# EAGLE schematic power5V (EAGLE 9.6.2)
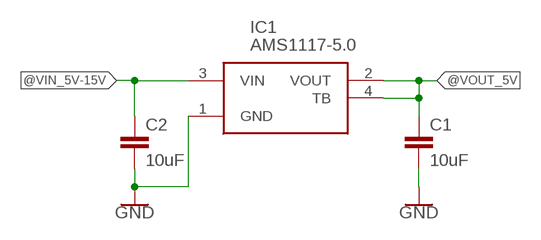
[diagram p0: schematic, sheet 1]

## Parts
C1  10uF  10UF-0603-6.3V-20%  [0603]
C2  10uF  10UF-0603-6.3V-20%  [0603]
IC1  AMS1117-5.0  [SOT290P700X180-4N]

## Nets
@VIN_5V-15V: C2.1 IC1.3(VIN)
@VOUT_5V: C1.1 IC1.2(VOUT) IC1.4(TB)
GND: C1.2 C2.2 IC1.1(GND)

## Library data of the parts
C1 C2 = SparkFun-Capacitors:10UF: 10.0µF ceramic capacitors A capacitor is a passive two-terminal electrical component used to store electrical energy temporarily in an electric field.; PROD_ID: CAP-11015
IC1 = AMS1117-5.0:AMS1117-5.0: Low Dropout Regulators(LDO) SOT-223 RoHS Source: Datasheet <https://datasheet.lcsc.com/szlcsc/SK-AMS1117-5-0_C165483.pdf>; DESCRIPTION: Low Dropout Regulators(LDO) SOT-223 RoHS; HEIGHT: 1.8mm; MANUFACTURER_NAME: Shikues; MANUFACTURER_PART_NUMBER: AMS1117-5.0